# EAGLE design DOORLOCK_v5 (EAGLE 7.6.0)
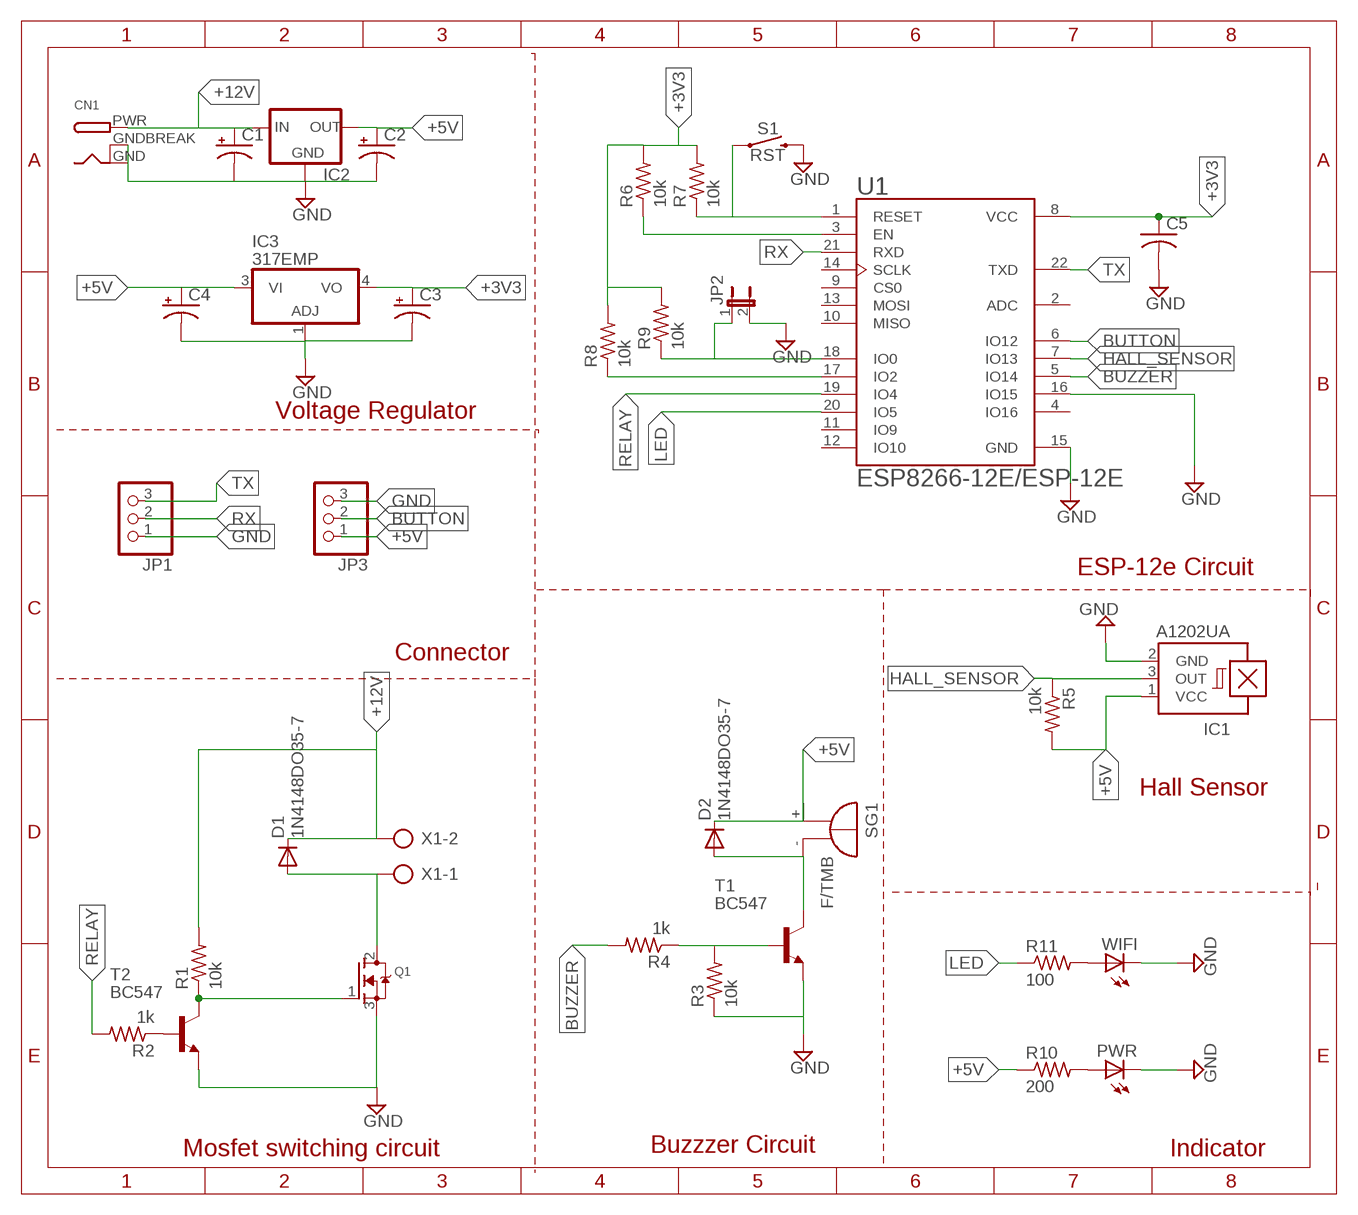
[diagram p0: schematic, sheet 1]

## Parts
C1  CPOL-USE2.5-5  [E2,5-5]
C2  CPOL-USE2.5-5  [E2,5-5]
C3  CPOL-USE2.5-5  [E2,5-5]
C4  CPOL-USE2.5-5  [E2,5-5]
C5  C-US025-030X050  [C025-030X050]
CN1  DCBARRELPTH  [DCJACK_2MM_PTH]
D1  1N4148DO35-7  [DO35-7]
D2  1N4148DO35-7  [DO35-7]
IC1  A1202UA  [SIP3-UA]
IC2  78XXS  [78XXS]
IC3  317EMP  [SOT223]
JP1  PINHD-1X3  [1X03]
JP2  JP1E  [JP1]
JP3  PINHD-1X3  [1X03]
PWR  LED3MM  [LED3MM]
Q1  MOSFET-NGDS_TO220V  [TO220V]
R1  10k  R-US_0207/2V  [0207/2V]
R2  1k  R-US_0207/2V  [0207/2V]
R3  10k  R-US_0207/2V  [0207/2V]
R4  1k  R-US_0207/2V  [0207/2V]
R5  10k  R-US_0207/2V  [0207/2V]
R6  10k  R-US_0207/2V  [0207/2V]
R7  10k  R-US_0207/2V  [0207/2V]
R8  10k  R-US_0207/2V  [0207/2V]
R9  10k  R-US_0207/2V  [0207/2V]
R10  200  R-US_0207/2V  [0207/2V]
R11  100  R-US_0207/2V  [0207/2V]
S1  RST  MOMENTARY-SWITCH-SPST-PTH-6.0MM  [TACTILE_SWITCH_PTH_6.0MM]
SG1  F/TMB  [F/TMB]
T1  BC547  [TO92]
T2  BC547  [TO92]
U1  ESP8266-12E/ESP-12E  [XCVR_ESP8266-12E/ESP-12E]
WIFI  LED3MM  [LED3MM]
X1  AK500/2-H  [AK500/2-H]

## Nets
+3V3: C3.+ C5.1 IC3.4(VO) R6.2 R7.2 R8.2 R9.2 U1.8(VCC)
+5V: C2.+ C4.+ D2.C IC1.1(VCC) IC2.OUT IC3.3(VI) JP3.1 R5.2 R10.1 SG1.+
+12V [+12v]: C1.+ CN1.PWR D1.C IC2.IN R1.2 X1.2
BUTTON: JP3.2 U1.6(IO12)
BUZZER: R4.2 U1.5(IO14)
GND: C1.- C2.- C3.- C4.- C5.2 CN1.GND CN1.GNDBREAK IC1.2(GND) IC2.GND IC3.1(ADJ) JP1.1 JP2.2 JP3.3 PWR.K(C) Q1.3(S) R3.1 S1.3 T1.1(E) T2.1(E) U1.15(GND) U1.16(IO15) WIFI.K(C)
HALL_SENSOR: IC1.3(OUT) R5.1 U1.7(IO13)
LED: R11.1 U1.20(IO5)
N$1: Q1.1(G) R1.1 T2.3(C)
N$2: D2.A SG1.- T1.3(C)
N$3 [+12v]: D1.A Q1.2(D) X1.1
N$4: R3.2 R4.1 T1.2(B)
N$6: R2.1 T2.2(B)
N$7: R8.1 U1.17(IO2)
N$8: R7.1 S1.1 U1.1(RESET)
N$9: R6.1 U1.3(EN)
N$10: JP2.1 R9.1 U1.18(IO0)
N$11: PWR.A R10.2
N$12: R11.2 WIFI.A
RELAY: R2.2 U1.19(IO4)
RX: JP1.2 U1.21(RXD)
TX: JP1.3 U1.22(TXD)
Unconnected: U1.2(ADC) U1.4(IO16) U1.9(CS0) U1.10(MISO) U1.11(IO9) U1.12(IO10) U1.13(MOSI) U1.14(SCLK)

## Notes on the sheet
- Voltage Regulator
- ESP-12e Circuit
- Connector
- Hall Sensor
- Mosfet switching circuit | Buzzzer Circuit | Indicator

## Library data of the parts
C1-C4 = adafruit:CPOL-US: POLARIZED CAPACITOR, American symbol
C5 = adafruit:C-US: CAPACITOR, American symbol
CN1 = adafruit:DCBARREL: 2.0mm DC Barrel Jack DCJACK_2MM_PTH - Through Hole Jack (4UConnector: 05537)
D1 D2 = diode:1N4148: DIODE high speed (Philips)
IC1 = allegro:A12*?: Hall-effect bipolar switch Source: http://www.allegromicro.com/en/Products/Part_Numbers/1202/1202.pdf; OC_FARNELL: unknown; OC_NEWARK: unknown
IC2 = v-reg:78XXS: VOLTAGE REGULATOR
IC3 = linear:*317: Positive VOLTAGE REGULATOR
JP1 JP3 = adafruit:PINHD-1X3: PIN HEADER
JP2 = jumper:JP1E: JUMPER
PWR WIFI = adafruit:LED: LED OSRAM: - CHIPLED LG R971, LG N971, LY N971, LG Q971, LY Q971, LO R971, LY R971 LH N974, LH R974 LS Q976, LO Q976, LY Q976 LO Q996 - Hyper CHIPLED LW Q18S LB Q993, LB Q99A, LB R99A - SideLED LS A670, LO A670, LY A670, LG A670, LP A670 LB A673, LV A673, LT A673, LW A673 LH A674 LY A675 LS A676, LA A676, LO A676, LY A676, LW A676 LS A679, LY A679, LG A679 - Hyper Micro SIDELED® LS Y876, LA Y876, LO Y876, LY Y876 LT Y87S - SmartLED LW L88C, LW L88S LB L89C, LB L89S, LG L890 LS L89K, LO L89K, LY L89K LS L896, LA L896, LO L896, LY L896 - TOPLED LS T670, LO T670, LY T670, LG T670, LP T670 LSG T670, LSP T670, LSY T670, LOP T670, LYG T670 LG T671, LOG T671, LSG T671 LB T673, LV T673, LT T673, LW T673 LH T674 LS T676, LA T676, LO T676, LY T676, LB T676, LH T676, LSB T676, LW T676 LB T67C, LV T67C, LT T67C, LS T67K, LO T67K, LY T67K, LW E67C LS E67B, LA E67B, LO E67B, LY E67B, LB E67C, LV E67C, LT E67C LW T67C LS T679, LY T679, LG T679 LS T770, LO T770, LY T770, LG T770, LP T770 LB T773, LV T773, LT T773, LW T773 LH T774 LS E675, LA E675, LY E675, LS T675 LS T776, LA T776, LO T776, LY T776, LB T776 LHGB T686 LT T68C, LB T68C - Hyper Mini TOPLED® LB M676 - Mini TOPLED Santana® LG M470 LS M47K, LO M47K, LY M47K Source: http://www.osram.convergy.de/
Q1 = adafruit:MOSFET-N: N-Channel Mosfet 2N7002E - 60V 260mA SOT23 [Digikey: 2N7002ET1GOSTR-ND] - REEL BSH103 - 30V 850mA SOT23 [Digikey: 568-5013-1-ND]
R1-R11 = adafruit:R-US_: RESISTOR, American symbol
S1 = SparkFun-Switches:MOMENTARY-SWITCH-SPST: Momentary Switch (Pushbutton) - SPST Normally-open (NO) SPST momentary switches (buttons, pushbuttons). Variants PTH-12MM - 12mm square, through-hole Momentary Pushbutton Switch - 12mm Square <https://www.sparkfun.com/products/9190> (COM-09190) PTH-6.0MM, PTH-6.0MM-KIT - 6.0mm square, through-hole Mini Pushbutton Switch <https://www.sparkfun.com/products/97> (COM-00097) KIT package intended for soldering kit's - only one side of pads' copper is exposed. PTH-RIGHT-ANGLE-KIT - Right-angle, through-hole Right Angle Tactile Button <https://www.sparkfun.com/products/10791> - Used on SparkFun BigTime Watch Kit <https://www.sparkfun.com/products/11734> SMD-12MM - 12mm square, surface-mount Tactile Button - SMD (12mm) <https://www.sparkfun.com/products/12993> (COM-12993) Used on SparkFun PicoBoard <https://www.sparkfun.com/products/11888> SMD-4.5MM - 4.5mm Square Trackball Switch Used on SparkFun Blackberry Trackballer Breakout <https://www.sparkfun.com/products/13169> SMD-4.6MMX2.8MM - 4.60mm x 2.80mm, surface mount Used on SparkFun SAMD21 Mini Breakout <https://www.sparkfun.com/products/13664> SMD-5.2MM, SMD-5.2-REDUNDANT - 5.2mm square, surface-mount Mini Pushbutton Switch - SMD <https://www.sparkfun.com/products/8720> (COM-08720) Used on Arduino Pro Mini <https://www.sparkfun.com/products/11114> REDUNDANT package connects both switch circuits together SMD-6.0X3.5MM - 6.0 x 3.5mm, surface mount Momentary Reset Switch SMD <https://www.sparkfun.com/products/8229> (COM-08229) SMD-6.2MM-TALL - 6.2mm square, surface mount Tactile Button - SMD (6mm) <https://www.sparkfun.com/products/12992> Used on SparkFun Digital Sandbox <https://www.sparkfun.com/products/12651> SMD-RIGHT-ANGLE - Right-angle, surface mount Used on SparkFun Block for Intel® Edison - Arduino <https://www.sparkfun.com/products/13036>; PROD_ID: SWCH-08441; SF_SKU: COM-00097
SG1 = buzzer:F/TMB: BUZZER Source: Buerklin; OC_FARNELL: unknown; OC_NEWARK: unknown
T1 T2 = transistor:BC547: NPN TRANSISTOR
U1 = ESP8266-12E_ESP-12E:ESP8266-12E/ESP-12E: ESP-12E WiFi Module; AVAILABILITY: Unavailable; DESCRIPTION: This WiFi module has a 32-bit MCU micro and clock speeds supporting 80 MHz or 160 MHz. Supports the RTOS and integrated Wi-Fi MAC/BB/RF/PA/LNA, and has an on-board antenna.; MF: AI-Thinker; MP: ESP8266-12E/ESP-12E; PACKAGE: None; PRICE: None
X1 = con-ptr500:AK500/2-H: CONNECTOR Aug. 2004 / PTR Meßtechnik: Die Bezeichnung der Serie AK505 wurde geändert. Es handelt sich hierbei um AK500 in horizontaler Ausführung.; OC_FARNELL: unknown; OC_NEWARK: unknown

## Net classes
0 default: width 0.5 mm, clearance 0.508 mm
1 +12v: width 0.8 mm, clearance 0.508 mm to class 0, clearance 0.508 mm

## Board
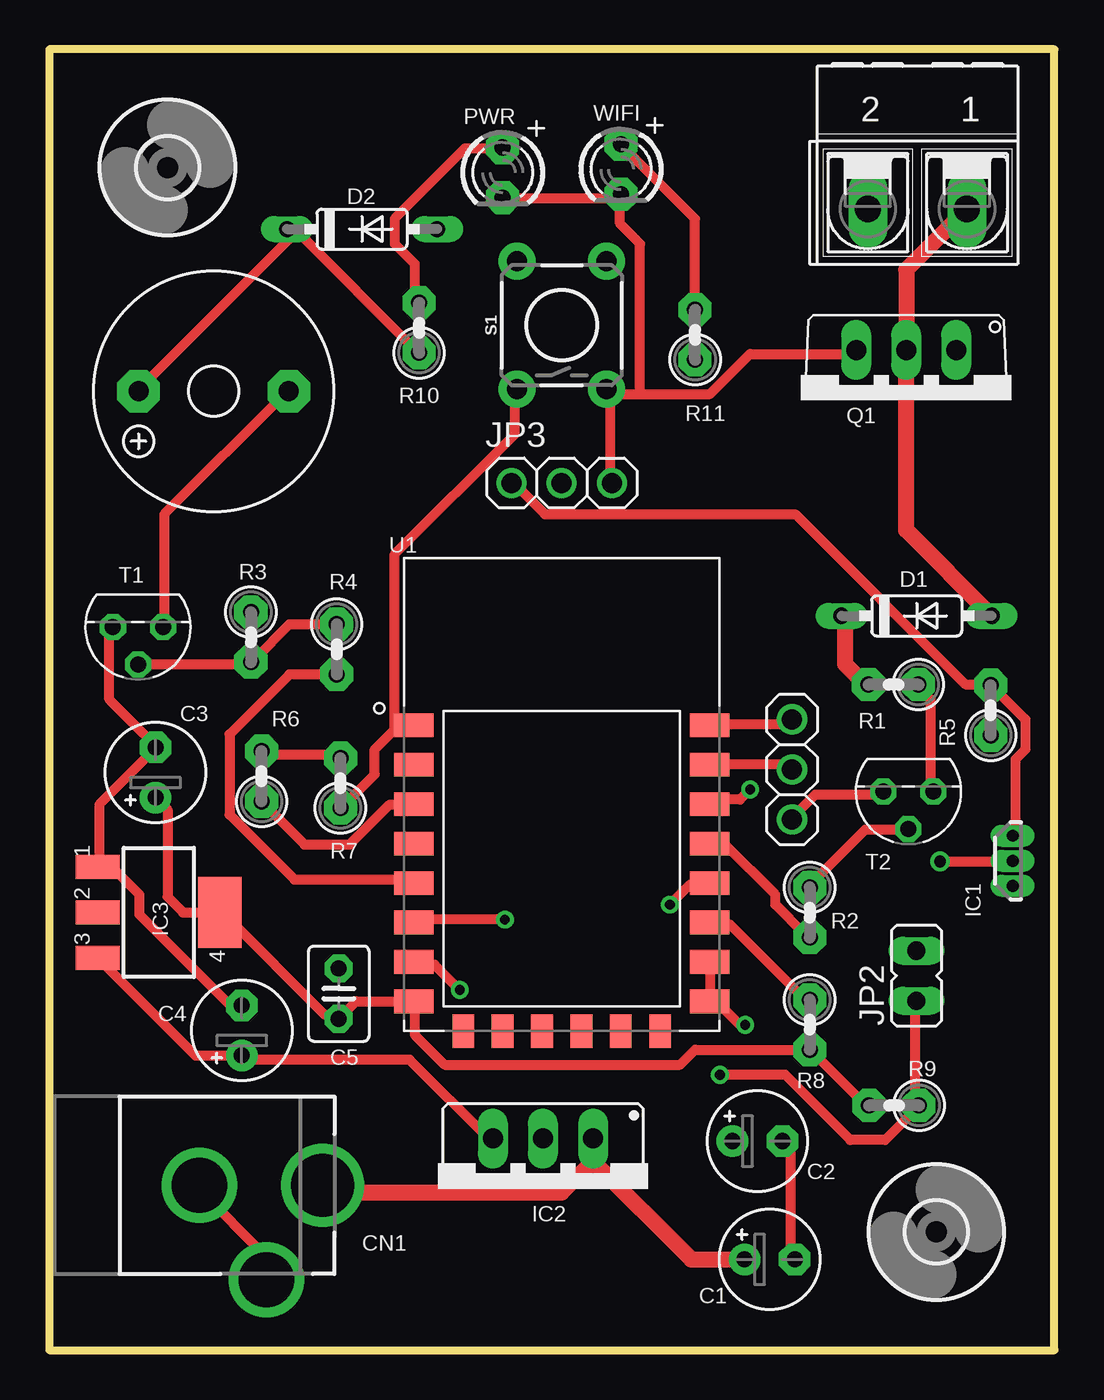
[diagram p1: board, top side]
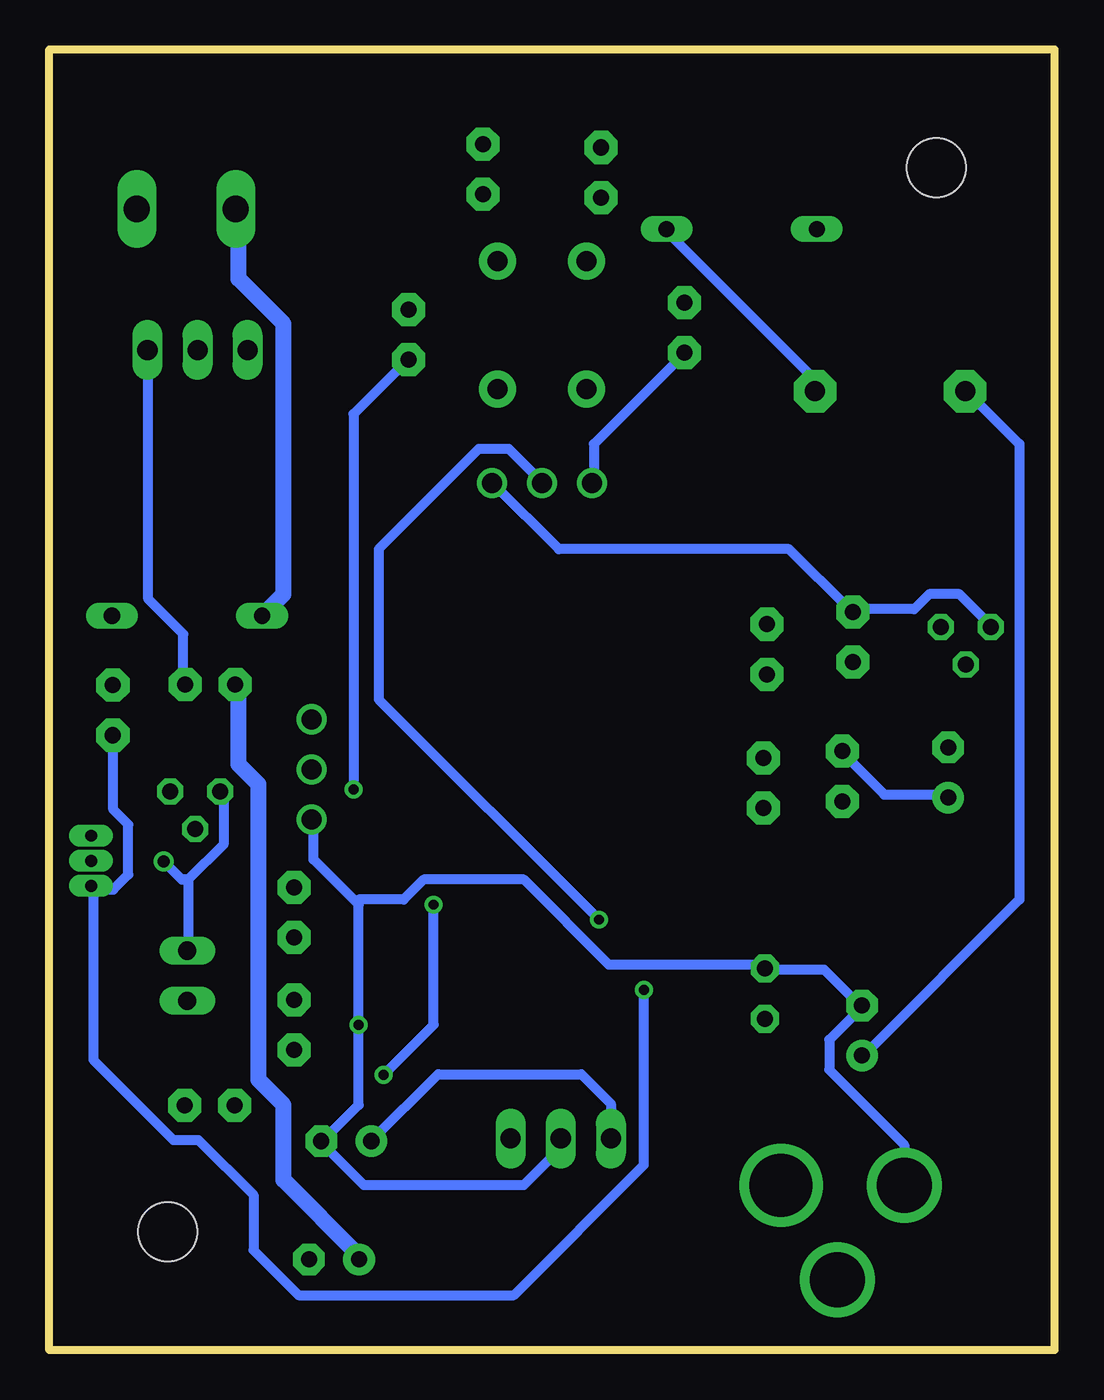
[diagram p2: board, bottom side, seen from below]

Size 51 x 66 mm. Coordinates in mm from the lower left corner, seen from the top.
Outline: 0,0 51,0 51,66 0,66 0,0
Copper layers (1*16): Top 0.035mm / dielectric 0.5mm / Bottom 0.035mm
Design rules "default *": minimum track width 20mil, minimum drill 10mil, track to track 15mil, track to pad 15mil, pad to pad 15mil, via to via 15mil, smd to smd 10mil, copper to edge 0.5mm, drill to drill 8mil, minimum pad ring 10mil, minimum via ring 8mil, stop-mask expansion 4mil, vias tented up to drill 0mil, thermal gap 10mil

### Footprints (pad centres in the part's own frame; a part is rotated, then mirrored left to right if it is on the bottom)
E2,5-5 = drill 0.813 pad 1.6: + -1.27,0 | drill 0.813 pad 1.6 octagon: - 1.27,0
C025-030X050 = drill 0.813 pad 1.422 octagon: 1 -1.27,0; 2 1.27,0
DCJACK_2MM_PTH = drill 2.8: GND 0,7.35; GNDBREAK 4.8,10.75 | drill 3.2: PWR 0,13.6
DO35-7 = drill 0.813 long: A 3.81,0; C -3.81,0
SIP3-UA = drill 0.6 pad 0.7 long: 1 -1.27,0; 2 0,0; 3 1.27,0
78XXS = drill 1.016 long: GND 0,-2.54; IN -2.54,-2.54; OUT 2.54,-2.54
SOT223 = smd 1.219 x 2.235: 1 -2.311,-3.099; 2 0,-3.099; 3 2.311,-3.099 | smd 3.6 x 2.2: 4 0,3.099
1X03 = drill 1.016: 1 -2.54,0; 2 0,0; 3 2.54,0
JP1 = drill 0.914 long: 1 0,-1.27; 2 0,1.27
LED3MM = drill 0.813 pad 1.676 octagon: A -1.27,0; K 1.27,0
TO220V = drill 1.016 long: 1 -2.54,-2.54; 2 0,-2.54; 3 2.54,-2.54
0207/2V = drill 0.813 pad 1.676 octagon: 1 -1.27,0; 2 1.27,0
TACTILE_SWITCH_PTH_6.0MM = drill 1.016 pad 1.88: 1 -3.251,2.261; 2 3.251,2.261; 3 -3.251,-2.261; 4 3.251,-2.261
F/TMB = drill 1.016 pad 2.159 octagon: + 3.81,0; - -3.81,0
TO92 = drill 0.813 octagon: 1 1.27,0; 2 0,1.905; 3 -1.27,0
XCVR_ESP8266-12E/ESP-12E = smd 2 x 1.2: 1 -7.5,7; 2 -7.5,5; 3 -7.5,3; 4 -7.5,1; 5 -7.5,-1; 6 -7.5,-3; 7 -7.5,-5; 8 -7.5,-7; 15 7.5,-7; 16 7.5,-5; 17 7.5,-3; 18 7.5,-1; 19 7.5,1; 20 7.5,3; 21 7.5,5; 22 7.5,7 | smd 1.1 x 1.7: 9 -5,-8.5; 10 -3,-8.5; 11 -1,-8.5; 12 1,-8.5; 13 3,-8.5; 14 5,-8.5
MOUNTINGHOLE_3.0 = hole 3: 0,0
AK500/2-H = drill 1.321 long: 1 -2.515,0; 2 2.515,0

### Placement (x,y rotation side)
C1  36.55,4.61 0 top
C2  35.93,10.61 0 top
C3  5.39,29.31 90 top
C4  9.77,16.22 90 top
C5  14.69,18.09 90 top
CN1  0.27,8.37 270 top
D1  44.01,37.26 0 top
D2  15.87,56.88 0 top
IC1  48.88,24.83 270 top
IC2  25.05,8.2 180 top
IC3  5.56,22.21 270 top
JP1  37.69,29.47 90 top
JP2  44,19 0 top
JP3  26,44 0 top
PWR  23,59.75 270 top
Q1  43.48,48.2 180 top
R1  42.83,33.77 180 top
R2  38.58,22.21 270 top
R3  10.23,36.18 270 top
R4  14.58,35.56 270 top
R5  47.77,32.47 90 top
R6  10.77,29.12 90 top
R7  14.77,28.77 90 top
R8  38.58,16.51 270 top
R9  42.86,12.42 180 top
R10  18.77,51.87 90 top
R11  32.77,51.52 90 top
S1  26,52 90 top
SG1  8.34,48.65 180 top
T1  4.5,36.69 180 top
T2  43.59,28.34 180 top
U1  26,24.7 0 top
U$1  [MOUNTINGHOLE_3.0]  6,60 0 top
U$2  [MOUNTINGHOLE_3.0]  45,6 0 top
WIFI  29,59.91 270 top
X1  44.05,57.9 180 top

### Tracks (layer width: path | path; a pad name or v marks a point on that pad's centre or on a via)
+3V3
  Top 0.5: C5.1 15.57,17.7 U1.8 | C3.+ 6,27.43 6,23 6.79,22.21 IC3.4
  Top 0.508: R9.2 41.4,12.45 38.61,15.24 R8.2 32.77,15.24 32,14.48 20.07,14.48 18.54,16 18.54,17.53 U1.8 | C5.1 14.48,17.02 13.97,17.02 8.89,22.1 IC3.4 | R7.2 14.73,30.23 10.92,30.23 R6.2
  Bottom 0.508: C3.+ 5.59,28.19 8.64,28.19 10.67,30.23 R6.2
+5V
  Top 0.5: IC3.3 7.41,14.95 C4.+
  Top 0.508: C4.+ 9.91,14.73 18.29,14.73 22.35,10.67 IC2.OUT | IC1.1 49.02,26.16 49.02,29.97 49.53,30.48 49.53,32 48.01,33.53 R5.2 47.75,33.78 46.48,33.78 37.85,42.42 25.15,42.42 23.62,43.94 JP3.1 | R10.1 18.54,50.8 12.7,56.64 12.19,56.64 D2.C 12.19,56.39 4.57,48.77 SG1.+
  Bottom 0.5: C2.+ 31.27,14 24,14 22.51,12.51 IC2.OUT
  Bottom 0.508: JP3.1 23.37,44.2 23.37,45.97 18.8,50.55 R10.1 | C4.+ 9.65,14.99 1.78,22.86 1.78,45.97 4.32,48.51 SG1.+
+12V
  Top 0.8: CN1.PWR 14.24,8 26,8 27.59,9.59 | 27.59,9.59 IC2.IN | 27.59,9.59 32.57,4.61 C1.+ | D1.C 40.39,37.08 40.39,34.8 41.4,33.78 R1.2
  Bottom 0.8: X1.2 41.4,57.66 41.4,54.36 39.12,52.07 39.12,38.35 40.13,37.34 D1.C | R1.2 41.4,33.53 41.4,29.72 40.39,28.7 40.39,13.72 39.12,12.45 39.12,8.64 35.31,4.83 C1.+
BUTTON  (via drill 0.5)
  Top 0.508: v23.11,21.84 18.54,21.84 U1.6
  Bottom 0.508: v23.11,21.84 34.29,33.02 34.29,40.64 29.21,45.72 27.69,45.72 26.16,44.2 JP3.2
BUZZER
  Top 0.508: R4.2 12.19,34.29 9.14,31.24 9.14,27.18 12.45,23.88 18.29,23.88 U1.5
GND  (via drill 0.5, 0.6)
  Top 0.5: v45.2,24.8 48.85,24.8 IC1.2
  Top 0.508: T2.1 42.16,28.19 38.86,28.19 37.85,27.18 JP1.1 | U1.16 33.53,19.56 33.53,17.78 U1.15 33.78,17.78 35.05,16.51 v35.31,16.51 | C1.- 37.59,4.83 37.59,10.16 37.34,10.41 C2.- | PWR.K 23.11,58.42 28.96,58.42 WIFI.K 28.96,58.17 28.96,57.15 29.97,56.13 29.97,48.51 | JP3.3 28.45,44.2 28.45,48.51 S1.3 28.7,48.51 29.97,48.51 | 29.97,48.51 33.53,48.51 35.56,50.55 40.89,50.55 Q1.3 | CN1.GNDBREAK 10.92,3.81 10.92,4.83 7.62,8.13 CN1.GND | T1.1 3.05,36.58 3.05,33.02 5.33,30.73 C3.- 5.33,30.48 2.54,27.69 2.54,24.64 IC3.1 2.79,24.64 3.05,24.64 4.57,23.11 4.57,22.1 9.14,17.53 9.65,17.53 C4.-
  Bottom 0.5: 43.94,23.88 44.28,23.88 v45.2,24.8
  Bottom 0.508: JP2.2 43.94,20.32 43.94,23.88 42.16,25.65 42.16,28.19 T2.1 | IC2.GND 25.15,10.67 25.15,10.16 26.92,8.38 35.05,8.38 37.08,10.41 C2.- 37.08,10.67 35.31,12.45 v35.31,16.51 35.31,22.61 35.43,22.73 | 35.43,22.73 37.59,24.89 37.59,26.92 JP1.1 | T1.1 3.3,36.83 4.83,38.35 6.35,38.35 7.11,37.59 10.16,37.59 R3.1 10.41,37.59 13.46,40.64 25.15,40.64 28.45,43.94 JP3.3 | CN1.GND 7.62,10.41 11.43,14.22 11.43,15.75 9.91,17.27 C4.- 9.91,17.53 11.68,19.3 14.48,19.3 C5.2 14.73,19.56 22.61,19.56 26.92,23.88 32,23.88 33.02,22.86 35.31,22.86 35.43,22.73
HALL_SENSOR  (via drill 0.5)
  Top 0.508: v20.83,18.29 19.56,19.56 18.54,19.56 U1.7
  Bottom 0.508: v20.83,18.29 20.83,9.4 27.43,2.79 38.35,2.79 40.64,5.08 40.64,7.87 43.43,10.67 44.7,10.67 48.77,14.73 48.77,23.37 IC1.3 48.51,23.37 47.75,23.37 46.99,24.13 46.99,26.67 47.75,27.43 47.75,30.99 R5.1
LED  (via drill 0.5)
  Top 0.508: v35.56,28.45 35.05,27.94 33.53,27.94 U1.20
  Bottom 0.508: v35.56,28.45 35.56,47.5 33.02,50.04 R11.1
N$1
  Top 0.508: T2.3 44.7,28.45 44.7,33.02 44.2,33.53 R1.1
  Bottom 0.508: Q1.1 45.97,50.55 45.97,38.1 44.2,36.32 44.2,33.78 R1.1
N$2
  Top 0.508: T1.3 5.84,36.83 5.84,42.42 11.94,48.51 SG1.-
  Bottom 0.508: D2.A 19.56,56.64 12.19,49.28 12.19,48.77 SG1.-
N$3
  Top 0.8: X1.1 43.48,54.81 Q1.2 43.48,41.6 D1.A
N$4
  Top 0.508: T1.2 4.57,34.8 10.16,34.8 R3.2 10.41,35.05 12.19,36.83 R4.1
N$6
  Top 0.508: T2.2 43.43,26.42 41.4,26.42 38.61,23.62 R2.1
N$7
  Top 0.508: U1.17 33.53,21.59 34.54,21.59 38.35,17.78 R8.1
N$8
  Top 0.508: 17.53,31.5 18.29,31.5 U1.1 17.53,31.5 | 17.53,31.5 16.51,30.48 16.51,29.21 14.99,27.69 R7.1 | 17.53,31.5 17.53,40.39 23.62,46.48 23.62,48.51 S1.1
N$9
  Top 0.508: U1.3 18.29,27.69 17.27,27.69 15.24,25.65 12.95,25.65 10.92,27.69 R6.1
N$10  (via drill 0.5)
  Top 0.508: v31.5,22.61 32.51,23.62 33.27,23.62 U1.18 | v34.04,13.97 37.34,13.97 40.64,10.67 42.42,10.67 43.94,12.19 R9.1 43.94,12.45 43.94,17.53 JP2.1
  Bottom 0.508: v31.5,22.61 31.5,16.51 v34.04,13.97
N$11
  Top 0.508: R10.2 18.54,53.34 18.54,55.12 17.53,56.13 17.53,57.4 21.08,60.96 22.86,60.96 PWR.A
N$12
  Top 0.508: WIFI.A 29.21,60.96 32.77,57.4 32.77,52.83 R11.2
RELAY
  Top 0.508: U1.19 33.53,25.65 34.29,25.65 36.83,23.11 36.83,22.61 38.35,21.08 R2.2
RX
  Top 0.508: U1.21 33.53,29.72 37.59,29.72 JP1.2
TX
  Top 0.508: U1.22 33.53,31.75 37.34,31.75 37.59,32 JP1.3

### Text on the board
_tNames: PWR | WIFI | D2 | S1 | R10 | R11 | Q1 | JP3 | T1 | U1 | R3 | R4 | D1 | C3 | R6 | R1 | R5 | R7 | T2 | IC3 | IC1 | R2 | C4 | JP2 | C5 | R9 | R8 | C2 | IC2 | CN1 | C1